# Altium schematic sheet Channel.SchDoc
size OrCAD E; SheetNumber: 2; SheetTotal: 2
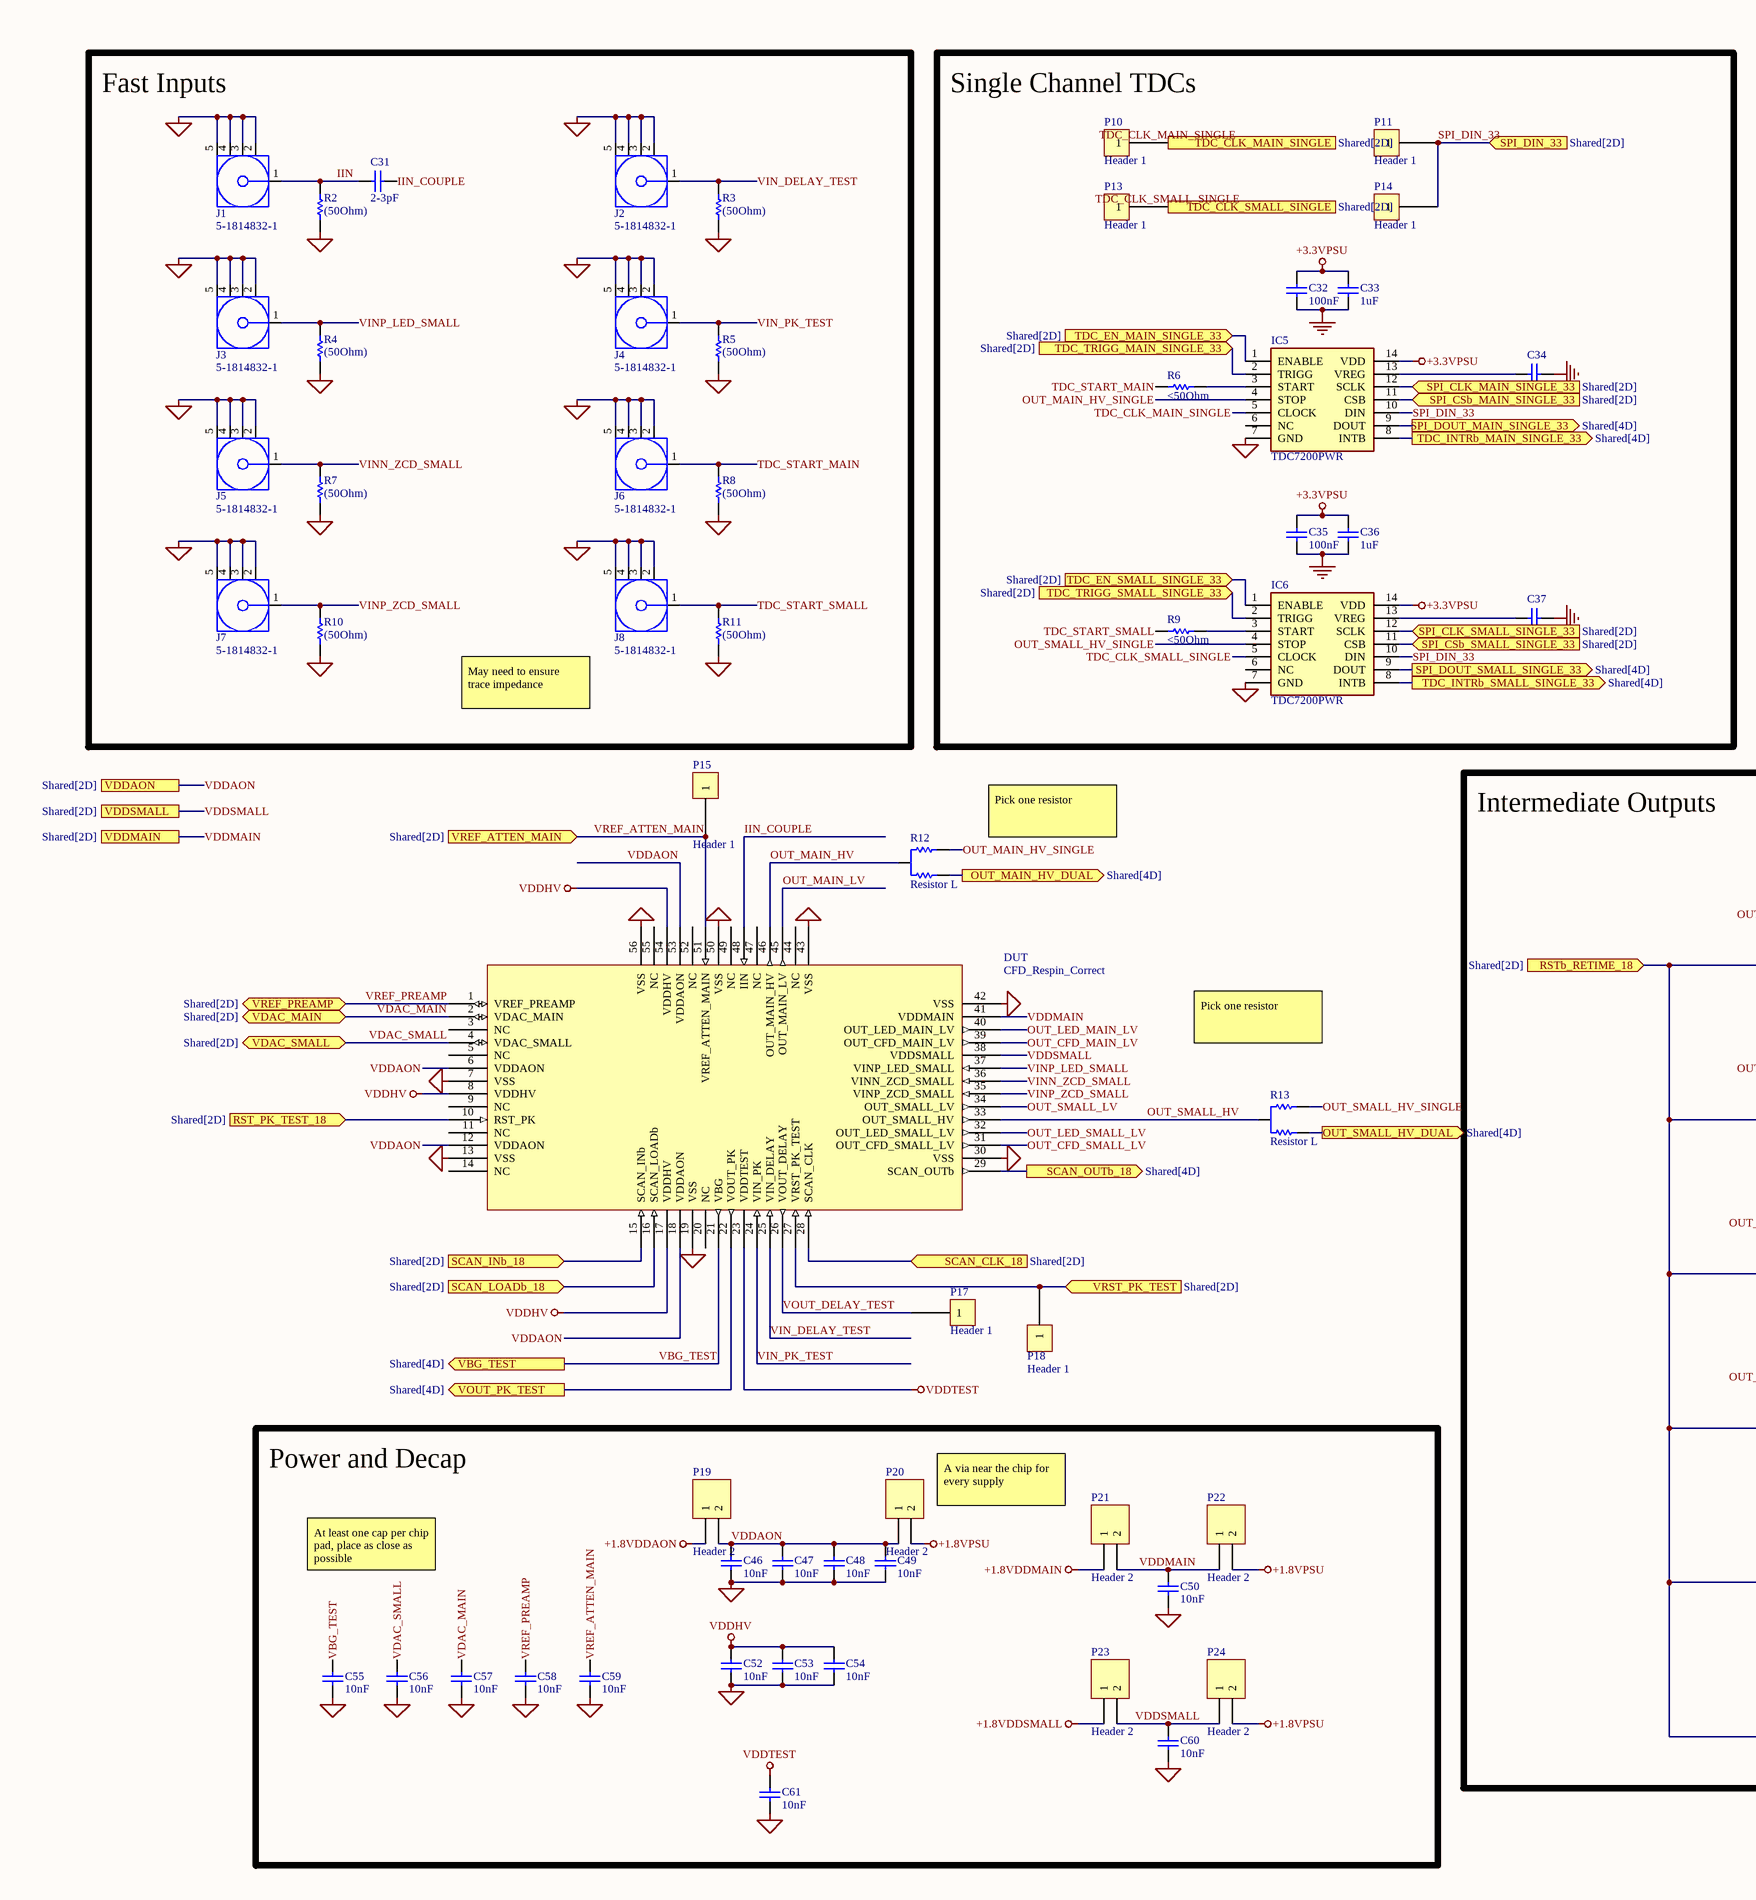
[diagram p0: Channel.SchDoc, left]
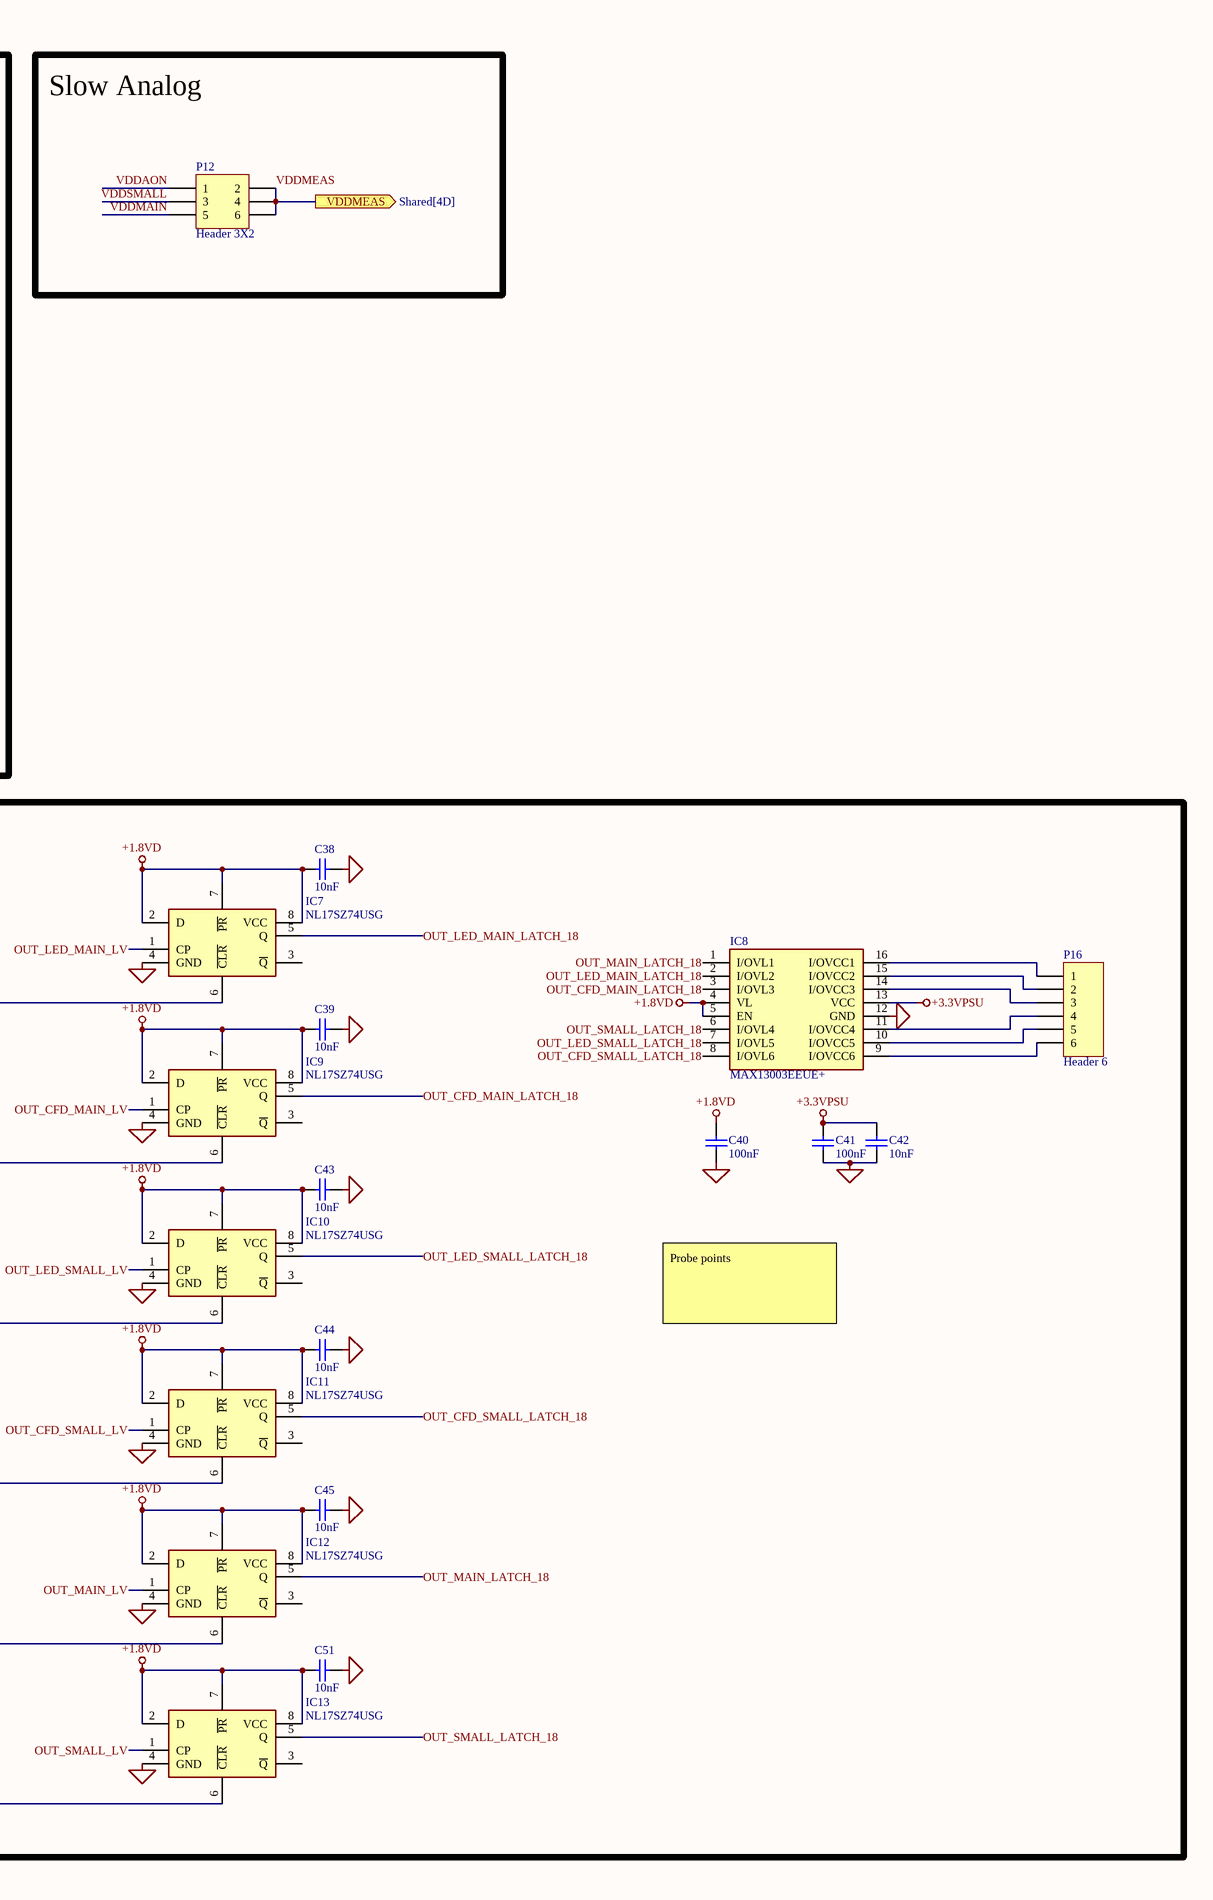
[diagram p1: Channel.SchDoc, right]

## Parts
C31  2-3pF  [CAPC1608X90X35ML10T15]
C32  100nF  [CAPC1608X90X35ML10T15]
C33  1uF  [CAPC1608X90X35ML10T15]
C34  1uF  [CAPC1608X90X35ML10T15]
C35  100nF  [CAPC1608X90X35ML10T15]
C36  1uF  [CAPC1608X90X35ML10T15]
C37  1uF  [CAPC1608X90X35ML10T15]
C38  10nF  [CAPC1608X90X35ML10T15]
C39  10nF  [CAPC1608X90X35ML10T15]
C40  100nF  [CAPC1608X90X35ML10T15]
C41  100nF  [CAPC1608X90X35ML10T15]
C42  10nF  [CAPC1608X90X35ML10T15]
C43  10nF  [CAPC1608X90X35ML10T15]
C44  10nF  [CAPC1608X90X35ML10T15]
C45  10nF  [CAPC1608X90X35ML10T15]
C46  10nF  [CAPC1608X90X35ML10T15]
C47  10nF  [CAPC1608X90X35ML10T15]
C48  10nF  [CAPC1608X90X35ML10T15]
C49  10nF  [CAPC1608X90X35ML10T15]
C50  10nF  [CAPC1608X90X35ML10T15]
C51  10nF  [CAPC1608X90X35ML10T15]
C52  10nF  [CAPC1608X90X35ML10T15]
C53  10nF  [CAPC1608X90X35ML10T15]
C54  10nF  [CAPC1608X90X35ML10T15]
C55  10nF  [CAPC1608X90X35ML10T15]
C56  10nF  [CAPC1608X90X35ML10T15]
C57  10nF  [CAPC1608X90X35ML10T15]
C58  10nF  [CAPC1608X90X35ML10T15]
C59  10nF  [CAPC1608X90X35ML10T15]
C60  10nF  [CAPC1608X90X35ML10T15]
C61  10nF  [CAPC1608X90X35ML10T15]
DUT  CFD_Respin_Correct  [QFN50P800X800X80_HS-57N_WIDEVIAS]
IC5  TDC7200PWR  [SOP65P640X120-14N]
IC6  TDC7200PWR  [SOP65P640X120-14N]
IC7  NL17SZ74USG  [SOP50P310X90-8N]
IC8  MAX13003EEUE+  [SOP65P640X110-16N]
IC9  NL17SZ74USG  [SOP50P310X90-8N]
IC10  NL17SZ74USG  [SOP50P310X90-8N]
IC11  NL17SZ74USG  [SOP50P310X90-8N]
IC12  NL17SZ74USG  [SOP50P310X90-8N]
IC13  NL17SZ74USG  [SOP50P310X90-8N]
J1  5-1814832-1  [TECO-5-1814832-1_V]
J2  5-1814832-1  [TECO-5-1814832-1_V]
J3  5-1814832-1  [TECO-5-1814832-1_V]
J4  5-1814832-1  [TECO-5-1814832-1_V]
J5  5-1814832-1  [TECO-5-1814832-1_V]
J6  5-1814832-1  [TECO-5-1814832-1_V]
J7  5-1814832-1  [TECO-5-1814832-1_V]
J8  5-1814832-1  [TECO-5-1814832-1_V]
P10  Header 1  [Header1]
P11  Header 1  [Header1]
P12  Header 3X2  [HDR2X3]
P13  Header 1  [Header1]
P14  Header 1  [Header1]
P15  Header 1  [Header1]
P16  Header 6  [HDR1X6]
P17  Header 1  [Header1]
P18  Header 1  [Header1]
P19  Header 2  [HDR1X2]
P20  Header 2  [HDR1X2]
P21  Header 2  [HDR1X2]
P22  Header 2  [HDR1X2]
P23  Header 2  [HDR1X2]
P24  Header 2  [HDR1X2]
R2  (50Ohm)  [RESC1609X50X30NL8T20]
R3  (50Ohm)  [RESC1609X50X30NL8T20]
R4  (50Ohm)  [RESC1609X50X30NL8T20]
R5  (50Ohm)  [RESC1609X50X30NL8T20]
R6  <50Ohm  [RESC1609X50X30NL8T20]
R7  (50Ohm)  [RESC1609X50X30NL8T20]
R8  (50Ohm)  [RESC1609X50X30NL8T20]
R9  <50Ohm  [RESC1609X50X30NL8T20]
R10  (50Ohm)  [RESC1609X50X30NL8T20]
R11  (50Ohm)  [RESC1609X50X30NL8T20]
R12  Resistor L  [RESL]
R13  Resistor L  [RESL]

## Blocks framed on the sheet
Fast Inputs: C31 J1-J8 R2-R5 R7 R8 R10 R11
Single Channel TDCs: C32-C37 IC5 IC6 P10 P11 P13 P14 R6 R9
Slow Analog: P12
Intermediate Outputs: C38-C45 C51 IC7-IC13 P16
Power and Decap: C46-C50 C52-C61 P19-P24

## Ports
OUT_MAIN_HV_DUAL (out, see Shared[4D]), OUT_SMALL_HV_DUAL (out, see Shared[4D]), RST_PK_TEST_18 (in, see Shared[2D]), RSTb_RETIME_18 (in, see Shared[2D]), SCAN_CLK_18 (in, see Shared[2D]), SCAN_INb_18 (in, see Shared[2D]), SCAN_LOADb_18 (in, see Shared[2D]), SCAN_OUTb_18 (out, see Shared[4D]), SPI_CLK_MAIN_SINGLE_33 (in, see Shared[2D]), SPI_CLK_SMALL_SINGLE_33 (in, see Shared[2D]), SPI_CSb_MAIN_SINGLE_33 (in, see Shared[2D]), SPI_CSb_SMALL_SINGLE_33 (in, see Shared[2D]), SPI_DIN_33 (in, see Shared[2D]), SPI_DOUT_MAIN_SINGLE_33 (out, see Shared[4D]), SPI_DOUT_SMALL_SINGLE_33 (out, see Shared[4D]), TDC_CLK_MAIN_SINGLE (in, see Shared[2D]), TDC_CLK_SMALL_SINGLE (in, see Shared[2D]), TDC_EN_MAIN_SINGLE_33 (in, see Shared[2D]), TDC_EN_SMALL_SINGLE_33 (in, see Shared[2D]), TDC_INTRb_MAIN_SINGLE_33 (out, see Shared[4D]), TDC_INTRb_SMALL_SINGLE_33 (out, see Shared[4D]), TDC_TRIGG_MAIN_SINGLE_33 (in, see Shared[2D]), TDC_TRIGG_SMALL_SINGLE_33 (in, see Shared[2D]), VBG_TEST (out, see Shared[4D]), VDAC_MAIN (bidir, see Shared[2D]), VDAC_SMALL (bidir, see Shared[2D]), VDDAON (see Shared[2D]), VDDMAIN (see Shared[2D]), VDDMEAS (out, see Shared[4D]), VDDSMALL (see Shared[2D]), VOUT_PK_TEST (out, see Shared[4D]), VREF_ATTEN_MAIN (in, see Shared[2D]), VREF_PREAMP (bidir, see Shared[2D]), VRST_PK_TEST (in, see Shared[2D])

## Nets
+1.8VD: C38.2 C39.2 C40.2 C43.2 C44.2 C45.2 C51.2 IC7.2(D) IC7.7(~{PR}) IC7.8(VCC) IC8.4(VL) IC8.5(EN) IC9.2(D) IC9.7(~{PR}) IC9.8(VCC) IC10.2(D) IC10.7(~{PR}) IC10.8(VCC) IC11.2(D) IC11.7(~{PR}) IC11.8(VCC) IC12.2(D) IC12.7(~{PR}) IC12.8(VCC) IC13.2(D) IC13.7(~{PR}) IC13.8(VCC)
+1.8VDDAON: P19.1
+1.8VDDMAIN: P21.1
+1.8VDDSMALL: P23.1
+1.8VPSU: P20.2 P22.2 P24.2
+3.3VPSU: C32.1 C33.1 C35.1 C36.1 C41.2 C42.2 IC5.14(VDD) IC6.14(VDD) IC8.13(VCC)
GND: C32.2 C33.2 C34.2 C35.2 C36.2 C37.2 C38.1 C39.1 C40.1 C41.1 C42.1 C43.1 C44.1 C45.1 C46.1 C47.1 C48.1 C49.1 C50.1 C51.1 C52.1 C53.1 C54.1 C55.1 C56.1 C57.1 C58.1 C59.1 C60.1 C61.1 DUT.7(VSS) DUT.13(VSS) DUT.19(VSS) DUT.30(VSS) DUT.42(VSS) DUT.43(VSS) DUT.50(VSS) DUT.56(VSS) IC5.7(GND) IC6.7(GND) IC7.4(GND) IC8.12(GND) IC9.4(GND) IC10.4(GND) IC11.4(GND) IC12.4(GND) IC13.4(GND) J1.2 J1.3 J1.4 J1.5 J2.2 J2.3 J2.4 J2.5 J3.2 J3.3 J3.4 J3.5 J4.2 J4.3 J4.4 J4.5 J5.2 J5.3 J5.4 J5.5 J6.2 J6.3 J6.4 J6.5 J7.2 J7.3 J7.4 J7.5 J8.2 J8.3 J8.4 J8.5 R2.1 R3.1 R4.1 R5.1 R7.1 R8.1 R10.1 R11.1
VDDHV: C52.2 C53.2 C54.2 DUT.8(VDDHV) DUT.17(VDDHV) DUT.54(VDDHV)
VDDTEST: C61.2 DUT.23(VDDTEST)
IIN: C31.1 J1.1 R2.2
IIN_COUPLE: C31.2 DUT.48(IIN)
OUT_CFD_MAIN_LATCH_18: IC8.3(I/OVL3) IC9.5(Q)
OUT_CFD_MAIN_LV: DUT.39(OUT_CFD_MAIN_LV) IC9.1(CP)
OUT_CFD_SMALL_LATCH_18: IC8.8(I/OVL6) IC11.5(Q)
OUT_CFD_SMALL_LV: DUT.31(OUT_CFD_SMALL_LV) IC11.1(CP)
OUT_LED_MAIN_LATCH_18: IC7.5(Q) IC8.2(I/OVL2)
OUT_LED_MAIN_LV: DUT.40(OUT_LED_MAIN_LV) IC7.1(CP)
OUT_LED_SMALL_LATCH_18: IC8.7(I/OVL5) IC10.5(Q)
OUT_LED_SMALL_LV: DUT.32(OUT_LED_SMALL_LV) IC10.1(CP)
OUT_MAIN_HV: DUT.46(OUT_MAIN_HV) R12.1
OUT_MAIN_HV_DUAL: R12.2 ; port OUT_MAIN_HV_DUAL
OUT_MAIN_HV_SINGLE: IC5.4(STOP) R12.3
OUT_MAIN_LATCH_18: IC8.1(I/OVL1) IC12.5(Q)
OUT_MAIN_LV: DUT.45(OUT_MAIN_LV) IC12.1(CP)
OUT_SMALL_HV: DUT.33(OUT_SMALL_HV) R13.1
OUT_SMALL_HV_DUAL: R13.2 ; port OUT_SMALL_HV_DUAL
OUT_SMALL_HV_SINGLE: IC6.4(STOP) R13.3
OUT_SMALL_LATCH_18: IC8.6(I/OVL4) IC13.5(Q)
OUT_SMALL_LV: DUT.34(OUT_SMALL_LV) IC13.1(CP)
RST_PK_TEST_18: DUT.10(RST_PK) ; port RST_PK_TEST_18
RSTb_RETIME_18: IC7.6(~{CLR}) IC9.6(~{CLR}) IC10.6(~{CLR}) IC11.6(~{CLR}) IC12.6(~{CLR}) IC13.6(~{CLR}) ; port RSTb_RETIME_18
SCAN_CLK_18: DUT.28(SCAN_CLK) ; port SCAN_CLK_18
SCAN_INb_18: DUT.15(SCAN_INb) ; port SCAN_INb_18
SCAN_LOADb_18: DUT.16(SCAN_LOADb) ; port SCAN_LOADb_18
SCAN_OUTb_18: DUT.29(SCAN_OUTb) ; port SCAN_OUTb_18
SPI_CLK_MAIN_SINGLE_33: IC5.12(SCLK) ; port SPI_CLK_MAIN_SINGLE_33
SPI_CLK_SMALL_SINGLE_33: IC6.12(SCLK) ; port SPI_CLK_SMALL_SINGLE_33
SPI_CSb_MAIN_SINGLE_33: IC5.11(CSB) ; port SPI_CSb_MAIN_SINGLE_33
SPI_CSb_SMALL_SINGLE_33: IC6.11(CSB) ; port SPI_CSb_SMALL_SINGLE_33
SPI_DIN_33: IC5.10(DIN) IC6.10(DIN) P11.1 P14.1 ; port SPI_DIN_33
SPI_DOUT_MAIN_SINGLE_33: IC5.9(DOUT) ; port SPI_DOUT_MAIN_SINGLE_33
SPI_DOUT_SMALL_SINGLE_33: IC6.9(DOUT) ; port SPI_DOUT_SMALL_SINGLE_33
TDC_CLK_MAIN_SINGLE: IC5.5(CLOCK) P10.1 ; port TDC_CLK_MAIN_SINGLE
TDC_CLK_SMALL_SINGLE: IC6.5(CLOCK) P13.1 ; port TDC_CLK_SMALL_SINGLE
TDC_EN_MAIN_SINGLE_33: IC5.1(ENABLE) ; port TDC_EN_MAIN_SINGLE_33
TDC_EN_SMALL_SINGLE_33: IC6.1(ENABLE) ; port TDC_EN_SMALL_SINGLE_33
TDC_INTRb_MAIN_SINGLE_33: IC5.8(INTB) ; port TDC_INTRb_MAIN_SINGLE_33
TDC_INTRb_SMALL_SINGLE_33: IC6.8(INTB) ; port TDC_INTRb_SMALL_SINGLE_33
TDC_START_MAIN: J6.1 R6.1 R8.2
TDC_START_SMALL: J8.1 R9.1 R11.2
TDC_TRIGG_MAIN_SINGLE_33: IC5.2(TRIGG) ; port TDC_TRIGG_MAIN_SINGLE_33
TDC_TRIGG_SMALL_SINGLE_33: IC6.2(TRIGG) ; port TDC_TRIGG_SMALL_SINGLE_33
VBG_TEST: C55.2 DUT.21(VBG) ; port VBG_TEST
VDAC_MAIN: C57.2 DUT.2(VDAC_MAIN) ; port VDAC_MAIN
VDAC_SMALL: C56.2 DUT.4(VDAC_SMALL) ; port VDAC_SMALL
VDDAON: C46.2 C47.2 C48.2 C49.2 DUT.6(VDDAON) DUT.12(VDDAON) DUT.18(VDDAON) DUT.53(VDDAON) P12.1 P19.2 P20.1 ; port VDDAON
VDDMAIN: C50.2 DUT.41(VDDMAIN) P12.5 P21.2 P22.1 ; port VDDMAIN
VDDMEAS: P12.2 P12.4 P12.6 ; port VDDMEAS
VDDSMALL: C60.2 DUT.38(VDDSMALL) P12.3 P23.2 P24.1 ; port VDDSMALL
VIN_DELAY_TEST: DUT.25(VIN_DELAY) J2.1 R3.2
VIN_PK_TEST: DUT.24(VIN_PK) J4.1 R5.2
VINN_ZCD_SMALL: DUT.36(VINN_ZCD_SMALL) J5.1 R7.2
VINP_LED_SMALL: DUT.37(VINP_LED_SMALL) J3.1 R4.2
VINP_ZCD_SMALL: DUT.35(VINP_ZCD_SMALL) J7.1 R10.2
VOUT_DELAY_TEST: DUT.26(VOUT_DELAY) P17.1
VOUT_PK_TEST: DUT.22(VOUT_PK) ; port VOUT_PK_TEST
VREF_ATTEN_MAIN: C59.2 DUT.51(VREF_ATTEN_MAIN) P15.1 ; port VREF_ATTEN_MAIN
VREF_PREAMP: C58.2 DUT.1(VREF_PREAMP) ; port VREF_PREAMP
VRST_PK_TEST: DUT.27(VRST_PK_TEST) P18.1 ; port VRST_PK_TEST
NetC34_1: C34.1 IC5.13(VREG)
NetC37_1: C37.1 IC6.13(VREG)
NetIC5_3: IC5.3(START) R6.2
NetIC6_3: IC6.3(START) R9.2
NetIC8_9: IC8.9(I/OVCC6) P16.6
NetIC8_10: IC8.10(I/OVCC5) P16.5
NetIC8_11: IC8.11(I/OVCC4) P16.4
NetIC8_14: IC8.14(I/OVCC3) P16.3
NetIC8_15: IC8.15(I/OVCC2) P16.2
NetIC8_16: IC8.16(I/OVCC1) P16.1

Not connected (* = marked no-connect by the designer): DUT 3(NC) 5(NC) 9(NC) 11(NC) 14(NC) 20(NC) 44(NC) 47(NC) 49(NC) 52(NC) 55(NC); IC5 6(NC); IC6 6(NC); IC7 3(~{Q}); IC9 3(~{Q}); IC10 3(~{Q}); IC11 3(~{Q}); IC12 3(~{Q}); IC13 3(~{Q})

## Notes on the sheet
- May need to ensure trace impedance
- Pick one resistor
- Probe points
- (near P20) A via near the chip for every supply
- At least one cap per chip pad, place as close as possible

## Library data of the parts
C31 = CMP-2000-04945-1: 0603,2-3pF; Manufacturer: Murata; Capacitance: 22pF; Tolerance (%): ±5%; Rated Voltage: 50V; Dielectric: C0G; Manufacturer URL: http://www.murata.com/; Datasheet Version: Jul-06; Package Reference: 603; Case Size/Dimension: 0603; Package Description: 2-Pin Surface Mount Device, Body 1.6 x 0.8 mm; Datasheet URL: https://datasheet.ciiva.com/11786/0900766b807a1cab-11786398.pdf
C32 C35 C40 C41 = CMP-2000-04945-1: 0603,100nF; Manufacturer: Murata; Capacitance: 22pF; Tolerance (%): ±5%; Rated Voltage: 50V; Dielectric: C0G; Manufacturer URL: http://www.murata.com/; Datasheet Version: Jul-06; Package Reference: 603; Case Size/Dimension: 0603; Package Description: 2-Pin Surface Mount Device, Body 1.6 x 0.8 mm; Datasheet URL: https://datasheet.ciiva.com/11786/0900766b807a1cab-11786398.pdf
C33 C34 C36 C37 = CMP-2000-04945-1: 0603,1uF; Manufacturer: Murata; Capacitance: 22pF; Tolerance (%): ±5%; Rated Voltage: 50V; Dielectric: C0G; Manufacturer URL: http://www.murata.com/; Datasheet Version: Jul-06; Package Reference: 603; Case Size/Dimension: 0603; Package Description: 2-Pin Surface Mount Device, Body 1.6 x 0.8 mm; Datasheet URL: https://datasheet.ciiva.com/11786/0900766b807a1cab-11786398.pdf
C38 C39 C42-C61 = CMP-2000-04945-1: 0603,10nF; Manufacturer: Murata; Capacitance: 22pF; Tolerance (%): ±5%; Rated Voltage: 50V; Dielectric: C0G; Manufacturer URL: http://www.murata.com/; Datasheet Version: Jul-06; Package Reference: 603; Case Size/Dimension: 0603; Package Description: 2-Pin Surface Mount Device, Body 1.6 x 0.8 mm; Datasheet URL: https://datasheet.ciiva.com/11786/0900766b807a1cab-11786398.pdf
IC5 IC6 = TDC7200PWR: Integrated Circuit; Manufacturer_Name: Texas Instruments; Datasheet Link: http://www.ti.com/lit/gpn/tdc7200; Height: 1.2mm; Manufacturer_Part_Number: TDC7200PWR
IC7 IC9-IC13 = NL17SZ74USG: Flip Flops 1.65-5.5V CMOS Single D-Type; Manufacturer_Name: ON Semiconductor; Datasheet Link: http://www.onsemi.com/pub/Collateral/NL17SZ74-D.PDF; Height: 0.9mm; Manufacturer_Part_Number: NL17SZ74USG
IC8 = MAX13003EEUE+: Integrated Circuit; Manufacturer_Name: Maxim Integrated; Datasheet Link: https://pdfserv.maximintegrated.com/en/ds/MAX13000E-MAX13005E.pdf; Height: 1.1mm; Manufacturer_Part_Number: MAX13003EEUE+
J1-J8 = CMP-2000-05415-1: SMA Connector, Pitch 5.08 mm, 1 Position, Height 9.5 mm, Tail Length 4 mm, -65 to 165 degC, RoHS, Bulk; Manufacturer: TE Connectivity; Connector Mounting: PCBMount; Connector Body Style: StraightJack; Impedance: 50ohm; Coaxial Termination: Solder; SVHC: NoSVHC(15-Jun-2015); Frequency Max: 3GHz; Product Range: ZDCSeries; Connector Type: SMACoaxial; Datasheet Version: Rev. B1, 03/2011; Package Reference: 5-1814832-1; Package Description: SMA Connector, Pitch 5.08 mm, 1 Position, Height 9.5 mm, Tail Length 4 mm; Contact Plating: GoldPlatedContacts; Coaxial Cable Types: -; Contact Material: BerylliumCopper; Manufacturer URL: http://www.te.com/; Datasheet URL: http://www.onlinecomponents.com/productFiles/mf-AMP/eng_cd_1814832_a.pdf
P12 = Header 3X2: Header, 3-Pin, Dual row; LatestRevisionDate: 17-Jul-2002; LatestRevisionNote: Re-released for DXP Platform.; Publisher: Altium Limited
P16 = Header 6: Header, 6-Pin; LatestRevisionDate: 17-Jul-2002; LatestRevisionNote: Re-released for DXP Platform.; Publisher: Altium Limited
P19-P24 = Header 2: Header, 2-Pin; LatestRevisionDate: 17-Jul-2002; LatestRevisionNote: Re-released for DXP Platform.; Publisher: Altium Limited
R2-R5 R7 R8 R10 R11 = CMP-2000-03816-5: 0603,(50Ohm),Do Not Populate; Manufacturer: Vishay Semiconductor; Voltage Rating: 75 V; Package Quantity: 5000; DatasheetVersion: 06/2012; Min Operating Temperature: -55 degC; ComponentLink1URL: http://www.vishay.com/; Mounting Technology: Surface Mount; Height: 0.45 mm; ComponentLink1Description: Manufacturer URL; REACH SVHC: Unknown; PackageReference: 0603; Packaging: Tape and Reel; Max Operating Temperature: 155 degC; Mount: Surface Mount; ComponentLink2Description: Datasheet; PackageDescription: 2-Pin Surface Mount Device, Body 1.575 x 0.85 mm; Length: 1.55 mm; ComponentLink2URL: http://www.vishay.com/docs/20035/dcrcwe3.pdf; Pins: 2; RoHSCompliant: true
R6 R9 = CMP-2000-03816-5: 0603,<50Ohm; Manufacturer: Vishay Semiconductor; Voltage Rating: 75 V; Package Quantity: 5000; DatasheetVersion: 06/2012; Min Operating Temperature: -55 degC; ComponentLink1URL: http://www.vishay.com/; Mounting Technology: Surface Mount; Height: 0.45 mm; ComponentLink1Description: Manufacturer URL; REACH SVHC: Unknown; PackageReference: 0603; Packaging: Tape and Reel; Max Operating Temperature: 155 degC; Mount: Surface Mount; ComponentLink2Description: Datasheet; PackageDescription: 2-Pin Surface Mount Device, Body 1.575 x 0.85 mm; Length: 1.55 mm; ComponentLink2URL: http://www.vishay.com/docs/20035/dcrcwe3.pdf; Pins: 2; RoHSCompliant: true
R12 R13 = Resistor L: Pick one 0603,0Ohm